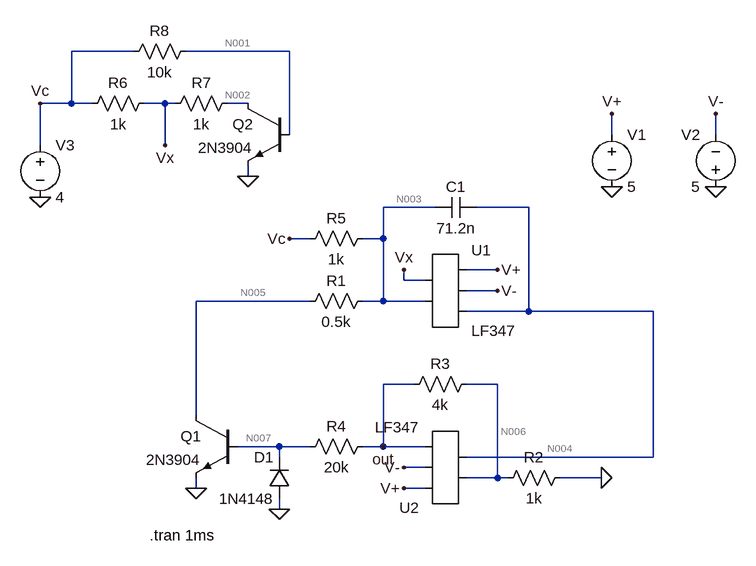
[diagram p0: schematic Draft3.asc]
* Draft3.asc
* U1: LF347 (symbol AutoGenerated\LF347 not available, pins judged from their places): pin1=Vx pin2=N003 pin3=V+ pin4=V- pin5=N004
V1 V+ 0 5
V2 0 V- 5
* U2: LF347 (symbol AutoGenerated\LF347 not available, pins judged from their places): pin1=N006 pin2=N004 pin3=V+ pin4=V- pin5=out
R1 N003 N005 0.5k
R2 0 N006 1k
R3 N006 out 4k
C1 N004 N003 71.2n
R4 out N007 20k
R5 N003 Vc 1k
V3 Vc 0 4
R6 Vx Vc 1k
R7 N002 Vx 1k
D1 0 N007 1N4148
Q1 N005 N007 0 0 2N3904
Q2 N002 N001 0 0 2N3904
R8 N001 Vc 10k
.model D D
.lib standard.dio
.model NPN NPN
.model PNP PNP
.lib standard.bjt
.tran 1ms
.backanno
.end

* Results of the author's LTspice run, read from the files saved beside the schematic
* Operating Point, zero values left out:
*   V(n004) = 161.2 mV
*   V(v-) = -5 V
*   V(v+) = 5 V
*   V(n003) = 2.014 V
*   V(vx) = 2.014 V
*   V(out) = 805.9 mV
*   V(n006) = 161.2 mV
*   V(n005) = 1.021 V
*   V(n007) = 673.2 mV
*   V(vc) = 4 V
*   V(n002) = 27.41 mV
*   V(n001) = 695.2 mV
*   Ic(Q2) = 1.986 mA
*   Ib(Q2) = 330.5 µA
*   Ie(Q2) = -2.317 mA
*   Ic(Q1) = 1.986 mA
*   Ib(Q1) = 6.631 µA
*   Ie(Q1) = -1.993 mA
*   I(D1) = -2.521 nA
*   I(R8) = -330.5 µA
*   I(R7) = -1.986 mA
*   I(R6) = -1.986 mA
*   I(R5) = -1.986 mA
*   I(R4) = 6.633 µA
*   I(R3) = -161.2 µA
*   I(R2) = -161.2 µA
*   I(R1) = 1.986 mA
*   I(V3) = -4.303 mA
*   I(V2) = -1.722 mA
*   I(V1) = -1.723 mA
*   Ix(u1:1) = 57.03 pA
*   Ix(u1:2) = 57.03 pA
*   Ix(u1:3) = 861.7 µA
*   Ix(u1:4) = -860.1 µA
*   Ix(u1:5) = -55.17 pA
*   Ix(u2:1) = 55.17 pA
*   Ix(u2:2) = 55.17 pA
*   Ix(u2:3) = 861.7 µA
*   Ix(u2:4) = -861.9 µA
*   Ix(u2:5) = -167.8 µA
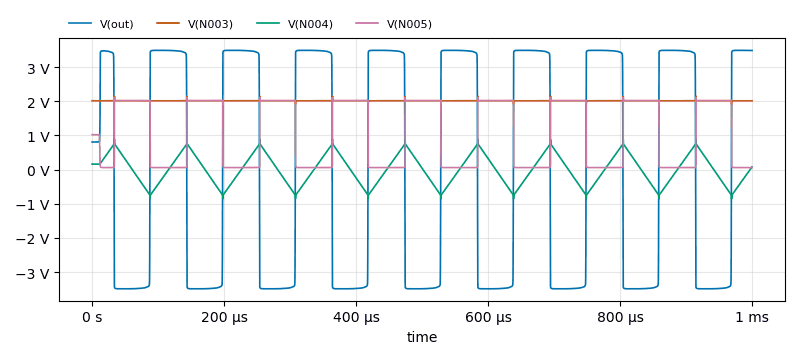
[diagram p1: Transient Analysis of Draft3.asc, plotted from the saved traces]
* Transient Analysis, 1 run:
*   V(out): min -3.487 V, max 3.487 V, average 45.56 mV, rms 3.436 V, last 3.484 V
*   V(N003): min 1.912 V, max 2.147 V, average 2.014 V, rms 2.014 V, last 2.012 V
*   V(N004): min -853.9 mV, max 888 mV, average 2.45 mV, rms 441.8 mV, last 77.4 mV
*   V(N005): min 58.38 mV, max 2.115 V, average 1.023 V, rms 1.411 V, last 58.4 mV